# Altium schematic sheet Divider.schdoc
size A4; PART_NAME: 2S200-PQ208-5; Organization: Altium Limited; Address1: L3, 12a Rodborough Rd; Address2: Frenchs Forest; Address3: NSW; Address4: Australia 2086; DocumentNumber: 3; SheetNumber: 3; SheetTotal: 3
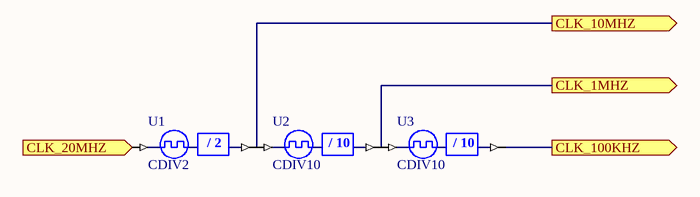
[diagram p0: Divider.schdoc]

## Parts
U1  CDIV2
U2  CDIV10
U3  CDIV10

## Ports
CLK_1MHZ (out), CLK_10MHZ (out), CLK_20MHZ (in), CLK_100KHZ (out)

## Nets
CLK_1MHZ: U2.CLKDV U3.CLKIN ; port CLK_1MHZ
CLK_10MHZ: U1.CLKDV U2.CLKIN ; port CLK_10MHZ
CLK_20MHZ: U1.CLKIN ; port CLK_20MHZ
CLK_100KHZ: U3.CLKDV ; port CLK_100KHZ

## Notes on the sheet
- Title
- Size:
- Date:
- A4
- Number:
- Time:
- Revision:
- Sheet
- of
- File:
- (in symbol CDIV2) / 2
- (in symbol CDIV10) / 10

## Library data of the parts
U1 = CDIV2: Clock Divider by 2; ArchiveName: GENERIC; Published: 18-Dec-2003; Publisher: Altium Limited; Core Revision: 1.00.00
U2 U3 = CDIV10: Clock Divider by 10; ArchiveName: GENERIC; Published: 18-Dec-2003; Publisher: Altium Limited; Core Revision: 1.00.00